# Altium schematic sheet 电源板2(1).SchDoc
size A3
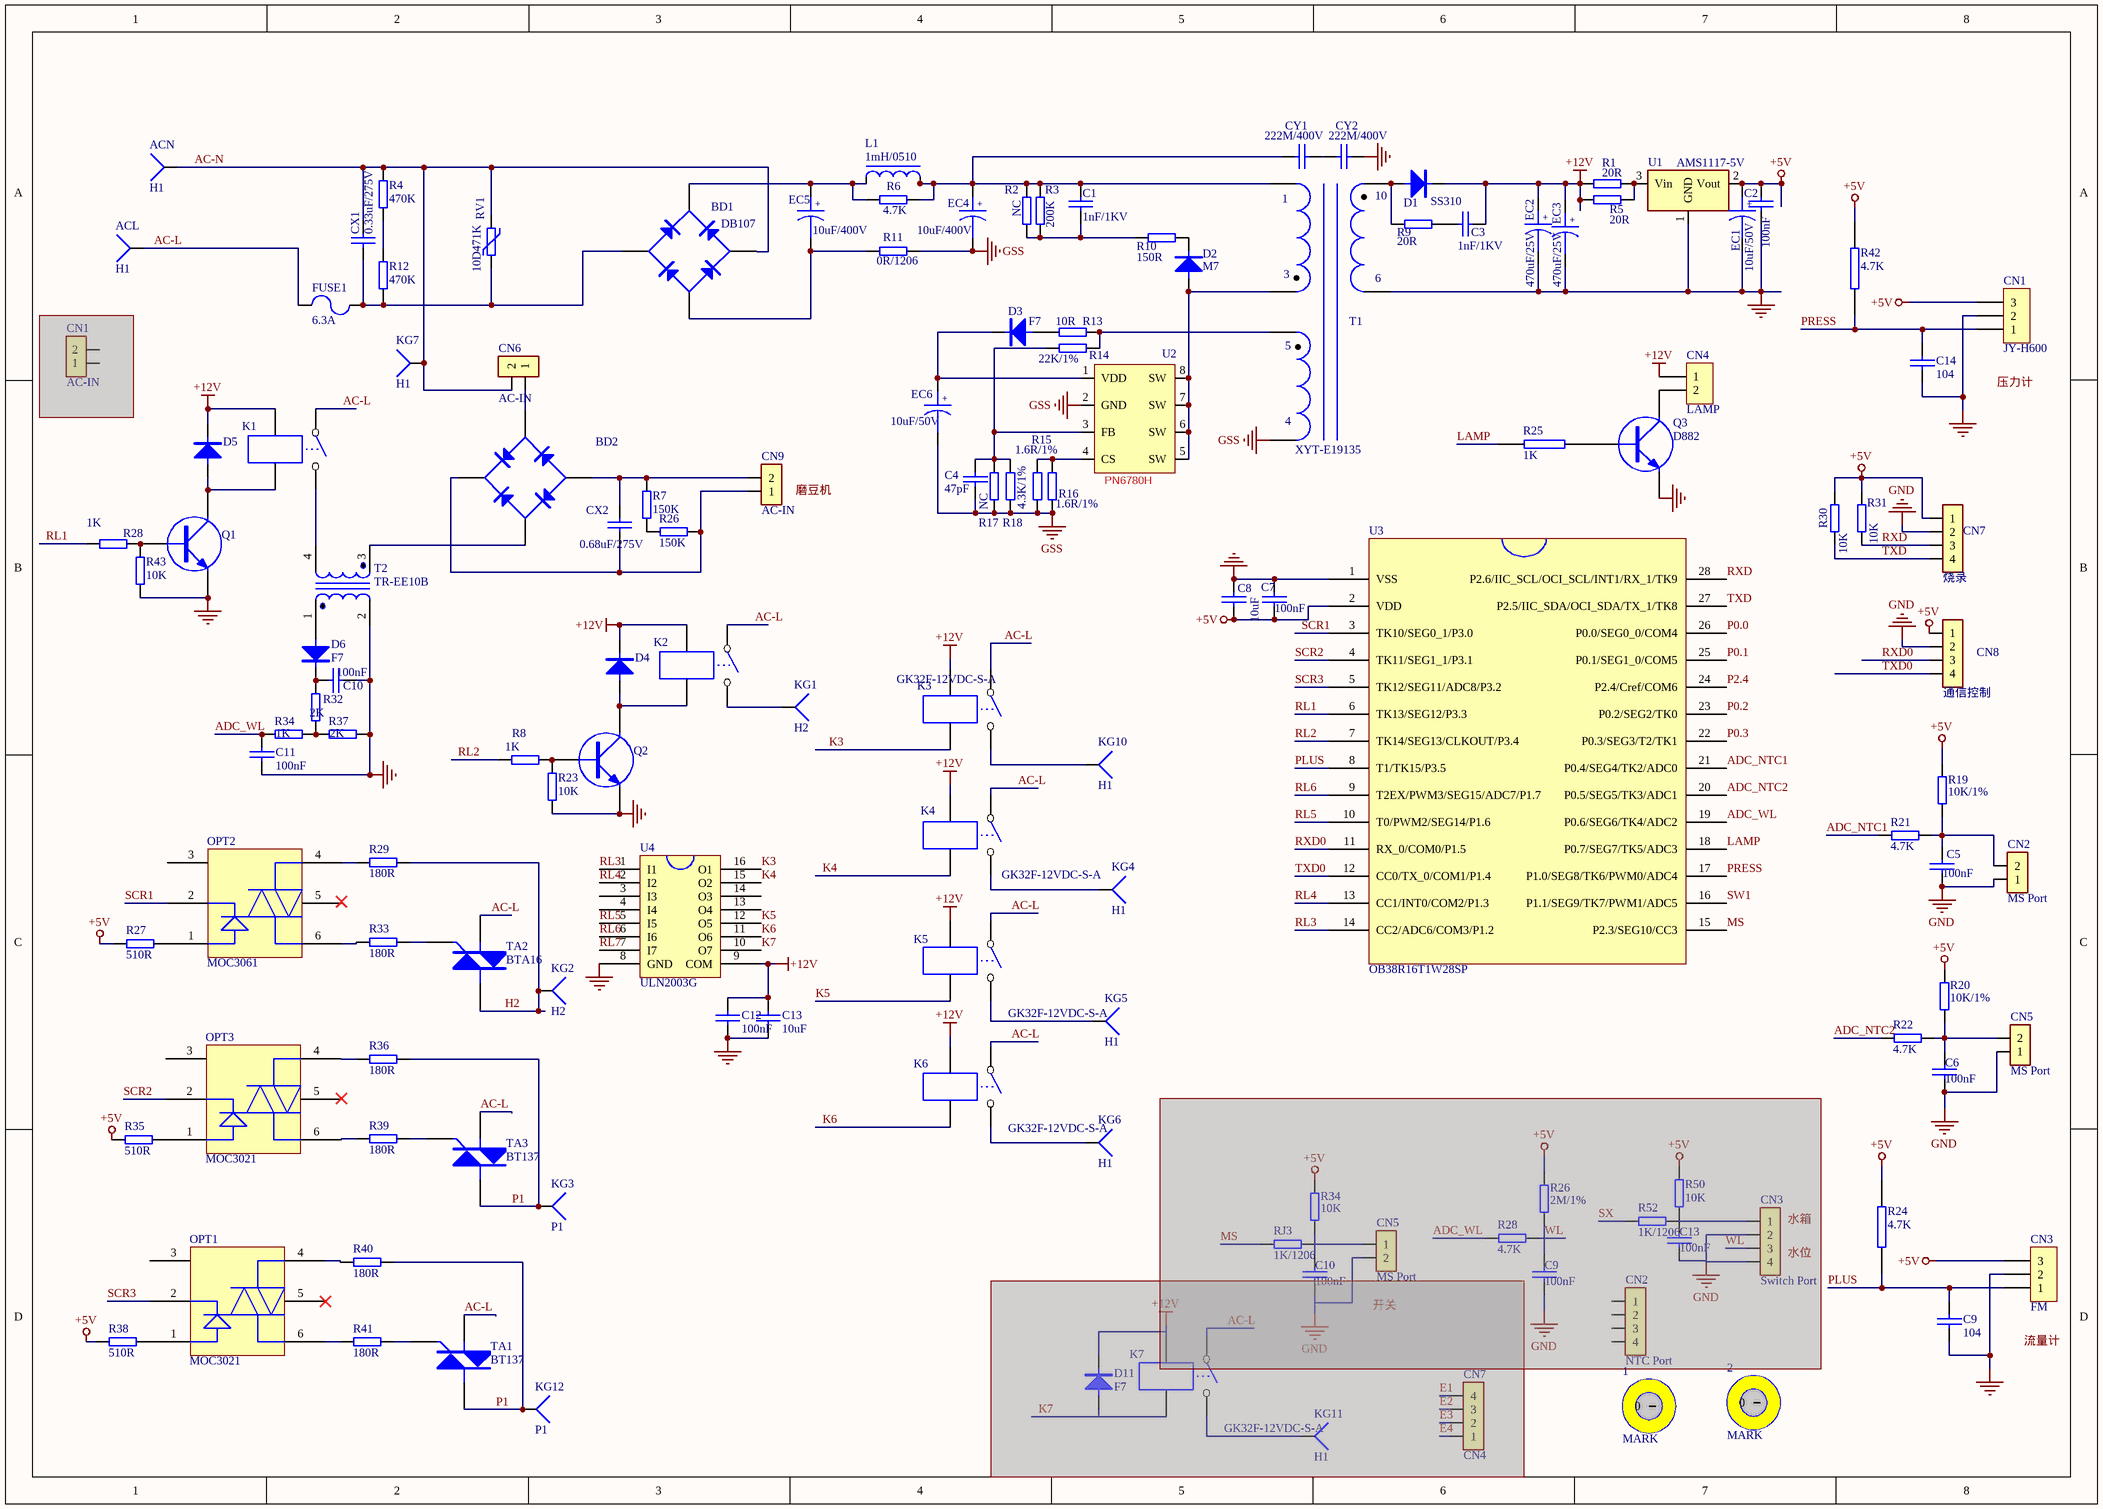
[diagram p0: 电源板2(1).SchDoc]

## Parts
(Parts that share a designator on the sheet are numbered #1, #2 ... from top to bottom, then left to right.)
1  MARK  [MARK]
2  MARK  [MARK]
ACL  H1  [250]
ACN  H1  [250]
BD1  DB107  [DB107S]
BD2  DB107  [KBP410]  (value not drawn)
C1  1nF/1KV  [C5A]
C2  100nF  [C0805]
C3  1nF/1KV  [C5A]
C4  47pF  [C0805]
C5  100nF  [C0805]
C6  100nF  [C0805]
C7  100nF  [C0805]
C8  10uF  [C1206]
C9#1  100nF  [C0805]  (masked out: inside a compile mask, not in the netlist)
C9#2  104  [C0805]
C10#1  100nF  [C0805]
C10#2  100nF  [C0805]  (masked out: inside a compile mask, not in the netlist)
C11  100nF  [C0805]
C12  100nF  [C0805]
C13#1  10uF  [C1206]
C13#2  100nF  [C0805]  (masked out: inside a compile mask, not in the netlist)
C14  104  [C0805]
CN1#1  JY-H600  [CN-2.54-3-Z]
CN1#2  AC-IN  [CN2-9.5]  (masked out: inside a compile mask, not in the netlist)
CN2#1  MS Port  [CN-2.54-2-Z]
CN2#2  NTC Port  [CN-2.54-4-Z]  (masked out: inside a compile mask, not in the netlist)
CN3#1  Switch Port  [CN-2.54-4-Z]  (masked out: inside a compile mask, not in the netlist)
CN3#2  FM  [CN-2.54-3-Z]
CN4  LAMP  [CN2 (带扣)]
CN5#1  MS Port  [CN-2.54-2-Z]
CN5#2  MS Port  [CN-2.54-2-Z]  (masked out: inside a compile mask, not in the netlist)
CN6  AC-IN  [VH-3A2]
CN7#1  烧录  [CN-2.54-4-Z]
CN7#2  CN4  [CN-VH3.96-4]  (masked out: inside a compile mask, not in the netlist)
CN8  通信控制  [CN-2.54-4-Z]
CN9  AC-IN  [VH-3A2]
CX1  0.33uF/275V  [C-0.33uF-13/8 -AI]
CX2  0.68uF/275V  [CX-18/11]
CY1  222M/400V  [C-332-13/4A - AI]
CY2  222M/400V  [C-332-13/4A - AI]
D1  SS310  [DO-214]
D2  M7  [DO-214]
D3  F7  [SOD-123]
D4  F7  [SOD-123]  (value not drawn)
D5  F7  [SOD-123]  (value not drawn)
D6  F7  [SOD-123]
D11  F7  [SOD-123]  (masked out: inside a compile mask, not in the netlist)
EC1  10uF/50V  [EC8]
EC2  470uF/25V  [EC8]
EC3  470uF/25V  [EC8]
EC4  10uF/400V  [E-5-10-AI]
EC5  10uF/400V  [E-5-10-AI]
EC6  10uF/50V  [EC5]
FUSE1  6.3A  [FUSE-5/8.5/4]
K1  GK32F-12VDC-S-A  [REL-1]  (value not drawn)
K2  GK32F-12VDC-S-A  [RY-3FF]  (value not drawn)
K3  GK32F-12VDC-S-A  [REL-1]
K4  GK32F-12VDC-S-A  [REL-1]
K5  GK32F-12VDC-S-A  [REL-1]
K6  GK32F-12VDC-S-A  [REL-1]
K7  GK32F-12VDC-S-A  [REL-1]  (masked out: inside a compile mask, not in the netlist)
KG1  H2  [250]
KG2  H2  [250]
KG3  P1  [250]
KG4  H1  [250]
KG5  H1  [250]
KG6  H1  [250]
KG7  H1  [250]
KG10  H1  [250]
KG11  H1  [250]  (masked out: inside a compile mask, not in the netlist)
KG12  P1  [250]
L1  1mH/0510  [R15/ 1W]
OPT1  MOC3021  [3021]
OPT2  MOC3061  [3021]
OPT3  MOC3021  [3021]
Q1  2222A  [SOT23-BCE]  (value not drawn)
Q2  2222A  [SOT23-BCE]  (value not drawn)
Q3  D882  [Q-TO126-ECB]
R1  20R  [R1206]
R2  NC  [R1206]
R3  200K  [R1206]
R4  470K  [R1206]
R5  20R  [R1206]
R6  4.7K  [R0805]
R7  150K  [R1206]
R8  1K  [R0805]
R9  20R  [R1206]
R10  150R  [R1206]
R11  0R/1206  [R1206]
R12  470K  [R1206]
R13  10R  [R0805]
R14  22K/1%  [R0805]
R15  1.6R/1%  [R1206]
R16  1.6R/1%  [R1206]
R17  NC  [R0805]
R18  4.3K/1%  [R0805]
R19  10K/1%  [R0805]
R20  10K/1%  [R0805]
R21  4.7K  [R0805]
R22  4.7K  [R0805]
R23  10K  [R0805]
R24  4.7K  [R0805]
R25  1K  [R0805]
R26#1  150K  [R1206]
R26#2  2M/1%  [R0805]  (masked out: inside a compile mask, not in the netlist)
R27  510R  [R0805]
R28#1  1K  [R0805]
R28#2  4.7K  [R0805]  (masked out: inside a compile mask, not in the netlist)
R29  180R  [R1206]
R30  10K  [R0805]
R31  10K  [R0805]
R32  2K  [R0805]
R33  180R  [R1206]
R34#1  1K  [R0805]
R34#2  10K  [R0805]  (masked out: inside a compile mask, not in the netlist)
R35  510R  [R0805]
R36  180R  [R1206]
R37  2K  [R0805]
R38  510R  [R0805]
R39  180R  [R1206]
R40  180R  [R1206]
R41  180R  [R1206]
R42  4.7K  [R0805]
R43  10K  [R0805]
R50  10K  [R1206]  (masked out: inside a compile mask, not in the netlist)
R52  1K/1206  [R1206]  (masked out: inside a compile mask, not in the netlist)
RJ3  1K/1206  [R1206]  (masked out: inside a compile mask, not in the netlist)
RV1  10D471K  [ZR-7.5-10]
T1  XYT-E19135  [EE19D]
T2  TR-EE10B  [互感器]
TA1  BT137  [TO252]
TA2  BTA16  [50*70]
TA3  BT137  [TO252]
U1  AMS1117-5V  [SOT-223]
U2  PN6780H  [DIP8]
U3  OB38R16T1W28SP  [SOP28-1.27]
U4  ULN2003G  [SOP16-1.27]

## Nets
+5V: C2.2 C7.1 C8.2 CN1#1.3 CN3#2.3 CN7#1.1 CN8.1 EC1.1 R19.2 R20.2 R24.2 R27.2 R30.1 R31.1 R35.2 R38.2 R42.2 U1.2(Vout) U3.2(VDD)
+12V: C3.2 C12.1 C13#1.2 CN4.1 D1.K D4.K D5.K EC2.1 EC3.1 K1.3 K2.3 K3.3 K4.3 K5.3 K6.3 R1.2 R5.2 U4.9(COM)
GND: C2.1 C5.1 C6.1 C7.2 C8.1 C9#2.2 C10#1.1 C11.2 C12.2 C13#1.1 C14.2 CN1#1.2 CN2#1.1 CN3#2.2 CN5#1.1 CN7#1.2 CN8.2 CY2.2 EC1.2 EC2.2 EC3.2 Q1.3(E) Q2.3(E) Q3.3(E) R23.1 R37.2 R43.1 T1.6 T2.2 U1.1(GND) U3.1(VSS) U4.8(GND)
GSS: C4.1 EC4.2 EC6.2 R11.2 R15.2 R16.1 R17.1 R18.1 T1.4 U2.2(GND)
AC-L: ACL.1 FUSE1.2 K1.1 K2.1 K3.1 K4.1 K5.1 K6.1 TA1.1(T) TA2.1(T) TA3.1(T)
AC-N: ACN.1 BD1.3(AC/N) CN6.2 CX1.2 KG7.1 R4.1 RV1.2
ADC_NTC1: R21.2 U3.21(P0.4/SEG4/TK2/ADC0)
ADC_NTC2: R22.2 U3.20(P0.5/SEG5/TK3/ADC1)
ADC_WL: C11.1 R34#1.1 U3.19(P0.6/SEG6/TK4/ADC2)
H2: KG2.1 R29.2 TA2.2(T)
K3: K3.4 U4.16(O1)
K4: K4.4 U4.15(O2)
K5: K5.4 U4.12(O5)
K6: K6.4 U4.11(O6)
K7: U4.10(O7)
LAMP: R25.2 U3.18(P0.7/SEG7/TK5/ADC3)
MS: U3.15(P2.3/SEG10/CC3)
P0.0: U3.26(P0.0/SEG0_0/COM4)
P0.1: U3.25(P0.1/SEG1_0/COM5)
P0.2: U3.23(P0.2/SEG2/TK0)
P0.3: U3.22(P0.3/SEG3/T2/TK1)
P1: KG3.1 KG12.1 R36.2 R40.2 TA1.2(T) TA3.2(T)
P2.4: U3.24(P2.4/Cref/COM6)
PLUS: C9#2.1 CN3#2.1 R24.1 U3.8(T1/TK15/P3.5)
PRESS: C14.1 CN1#1.1 R42.1 U3.17(P1.0/SEG8/TK6/PWM0/ADC4)
RL1: R28#1.1 U3.6(TK13/SEG12/P3.3)
RL2: R8.1 U3.7(TK14/SEG13/CLKOUT/P3.4)
RL3: U3.14(CC2/ADC6/COM3/P1.2) U4.1(I1)
RL4: U3.13(CC1/INT0/COM2/P1.3) U4.2(I2)
RL5: U3.10(T0/PWM2/SEG14/P1.6) U4.5(I5)
RL6: U3.9(T2EX/PWM3/SEG15/ADC7/P1.7) U4.6(I6)
RL7: U4.7(I7)
RXD: CN7#1.3 R31.2 U3.28(P2.6/IIC_SCL/OCI_SCL/INT1/RX_1/TK9)
RXD0: CN8.3 U3.11(RX_0/COM0/P1.5)
SCR1: OPT2.2 U3.3(TK10/SEG0_1/P3.0)
SCR2: OPT3.2 U3.4(TK11/SEG1_1/P3.1)
SCR3: OPT1.2 U3.5(TK12/SEG11/ADC8/P3.2)
SW1: U3.16(P1.1/SEG9/TK7/PWM1/ADC5)
TXD: CN7#1.4 R30.2 U3.27(P2.5/IIC_SDA/OCI_SDA/TX_1/TK8)
TXD0: CN8.4 U3.12(CC0/TX_0/COM1/P1.4)
NetBD1_1: BD1.1(V+) EC5.1 L1.1 R6.1
NetBD1_2: BD1.2(AC/L) CX1.1 FUSE1.1 R12.2 RV1.1
NetBD1_4: BD1.4(V-) EC5.2 R11.1
NetBD2_1: BD2.1(V+) CN9.1 CX2.1 R26#1.2
NetBD2_2: BD2.2(AC/L) T2.3
NetBD2_3: BD2.3(AC/N) CN6.1
NetBD2_4: BD2.4(V-) CN9.2 CX2.2 R7.1
NetC1_1: C1.1 R2.2 R3.2 R10.1
NetC1_2: C1.2 CY1.1 EC4.1 L1.2 R2.1 R3.1 R6.2 T1.1
NetC3_1: C3.1 R9.2
NetC4_2: C4.2 R14.2 R17.2 R18.2 U2.3(FB)
NetC5_2: C5.2 CN2#1.2 R19.1 R21.1
NetC6_2: C6.2 CN5#1.2 R20.1 R22.1
NetC10#1_2: C10#1.2 D6.K R32.1
NetCN4_2: CN4.2 Q3.2(C)
NetCY1_2: CY1.2 CY2.1
NetD1_A: D1.A R9.1 T1.10
NetD2_A: D2.A T1.3 U2.5(SW) U2.6(SW) U2.7(SW) U2.8(SW)
NetD2_K: D2.K R10.2
NetD3_A: D3.A R13.1
NetD3_K: D3.K EC6.1 U2.1(VDD)
NetD4_A: D4.A K2.4 Q2.2(C)
NetD5_A: D5.A K1.4 Q1.2(C)
NetD6_A: D6.A T2.1
NetK1_2: K1.2 T2.4
NetK2_2: K2.2 KG1.1
NetK3_2: K3.2 KG10.1
NetK4_2: K4.2 KG4.1
NetK5_2: K5.2 KG5.1
NetK6_2: K6.2 KG6.1
NetOPT1_1: OPT1.1 R38.1
NetOPT1_4: OPT1.4 R40.1
NetOPT1_6: OPT1.6 R41.1
NetOPT2_1: OPT2.1 R27.1
NetOPT2_4: OPT2.4 R29.1
NetOPT2_6: OPT2.6 R33.1
NetOPT3_1: OPT3.1 R35.1
NetOPT3_4: OPT3.4 R36.1
NetOPT3_6: OPT3.6 R39.1
NetQ1_1: Q1.1(B) R28#1.2 R43.2
NetQ2_1: Q2.1(B) R8.2 R23.2
NetQ3_1: Q3.1(B) R25.1
NetR1_1: R1.1 R5.1 U1.3(Vin)
NetR4_2: R4.2 R12.1
NetR7_2: R7.2 R26#1.1
NetR13_2: R13.2 R14.1 T1.5
NetR15_1: R15.1 R16.2 U2.4(CS)
NetR32_2: R32.2 R34#1.2 R37.1
NetR33_2: R33.2 TA2.3(G)
NetR39_2: R39.2 TA3.3(G)
NetR41_2: R41.2 TA1.3(G)

Not connected (* = marked no-connect by the designer): 1 ?1(0); 2 ?1(0); OPT1 3 5*; OPT2 3 5; OPT3 3 5; U4 3(I3) 4(I4) 13(O4) 14(O3)

## Notes on the sheet
- (near T1) 1
- 10
- (near T1) 3
- (near T1) 6
- (near T1) 5
- (near T1) 4
- Labels drawn without touching a wire or pin: 压力计, 流量计, 磨豆机
- (in symbol CAPACITOR POL) +

## Library data of the parts
ACL ACN KG1-KG7 KG10-KG12 = P: CN
BD1 BD2 = BRIDGE: pin to pad: 2>3 3>2
C1-C8 C9#1 C9#2 C10#1 C10#2 C11 C12 C13#1 C13#2 C14 CX1 CX2 CY1 CY2 = CAP: Capacitor
CN1#1 CN3#2 = CON3: Connector
CN1#2 CN2#1 CN5#1 CN5#2 CN6 CN9 = CN2
CN2#2 CN3#1 CN7#1 CN8 = CN4
CN4 = CON2: Connector
D1-D6 D11 = DIODE2
EC1-EC6 = CAPACITOR POL: Capacitor
FUSE1 = FUSE
K1-K7 = RELAY-SPST: pin to pad: 1>3 2>4 3>1 4>2
L1 = 滤波器M_1
OPT2 = MOC3021
Q1-Q3 = NPN: NPN Transistor; pin to pad: 1>b 2>c 3>e
R1-R23 R26#1 R26#2 R27 R28#1 R28#2 R29-R33 R34#1 R34#2 R35-R41 R43 R50 R52 RJ3 = RES
R24 R25 R42 = RES2
RV1 = VDR
T1 = EE
TA1-TA3 = TRIAC
U1 = IC-7805: 7805
U2 = 芯片-PN8680
U3 = OB38RO8T1W28SP